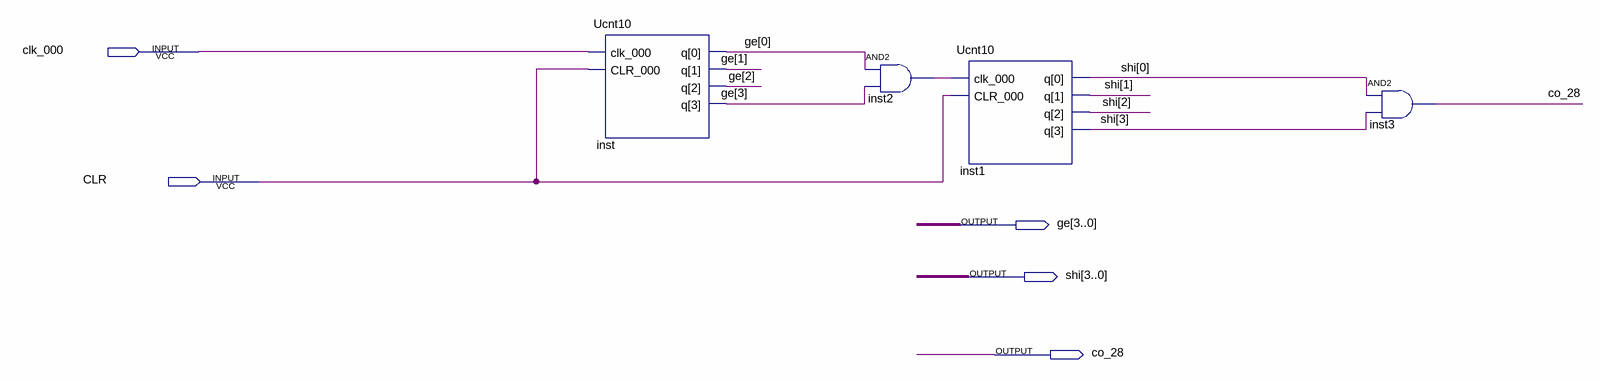
[diagram p0: schematic sheet]
// Quartus schematic Ucnt100.bdf as structural Verilog: 4 symbols, 5 pins
module Ucnt100 (
  input  clk_000,
  input  CLR,
  output [3:0] ge,
  output [3:0] shi,
  output co_28
);

  wire inst2_out;

  Ucnt10 inst (.clk_000(clk_000), .CLR_000(CLR), .q(ge));
  and inst2 (inst2_out, ge[0], ge[3]);
  Ucnt10 inst1 (.clk_000(inst2_out), .CLR_000(CLR), .q(shi));
  and inst3 (co_28, shi[0], shi[3]);
endmodule
